# Altium schematic sheet Inverter.SchDoc
size A2; SheetNumber: 2; SheetTotal: 5
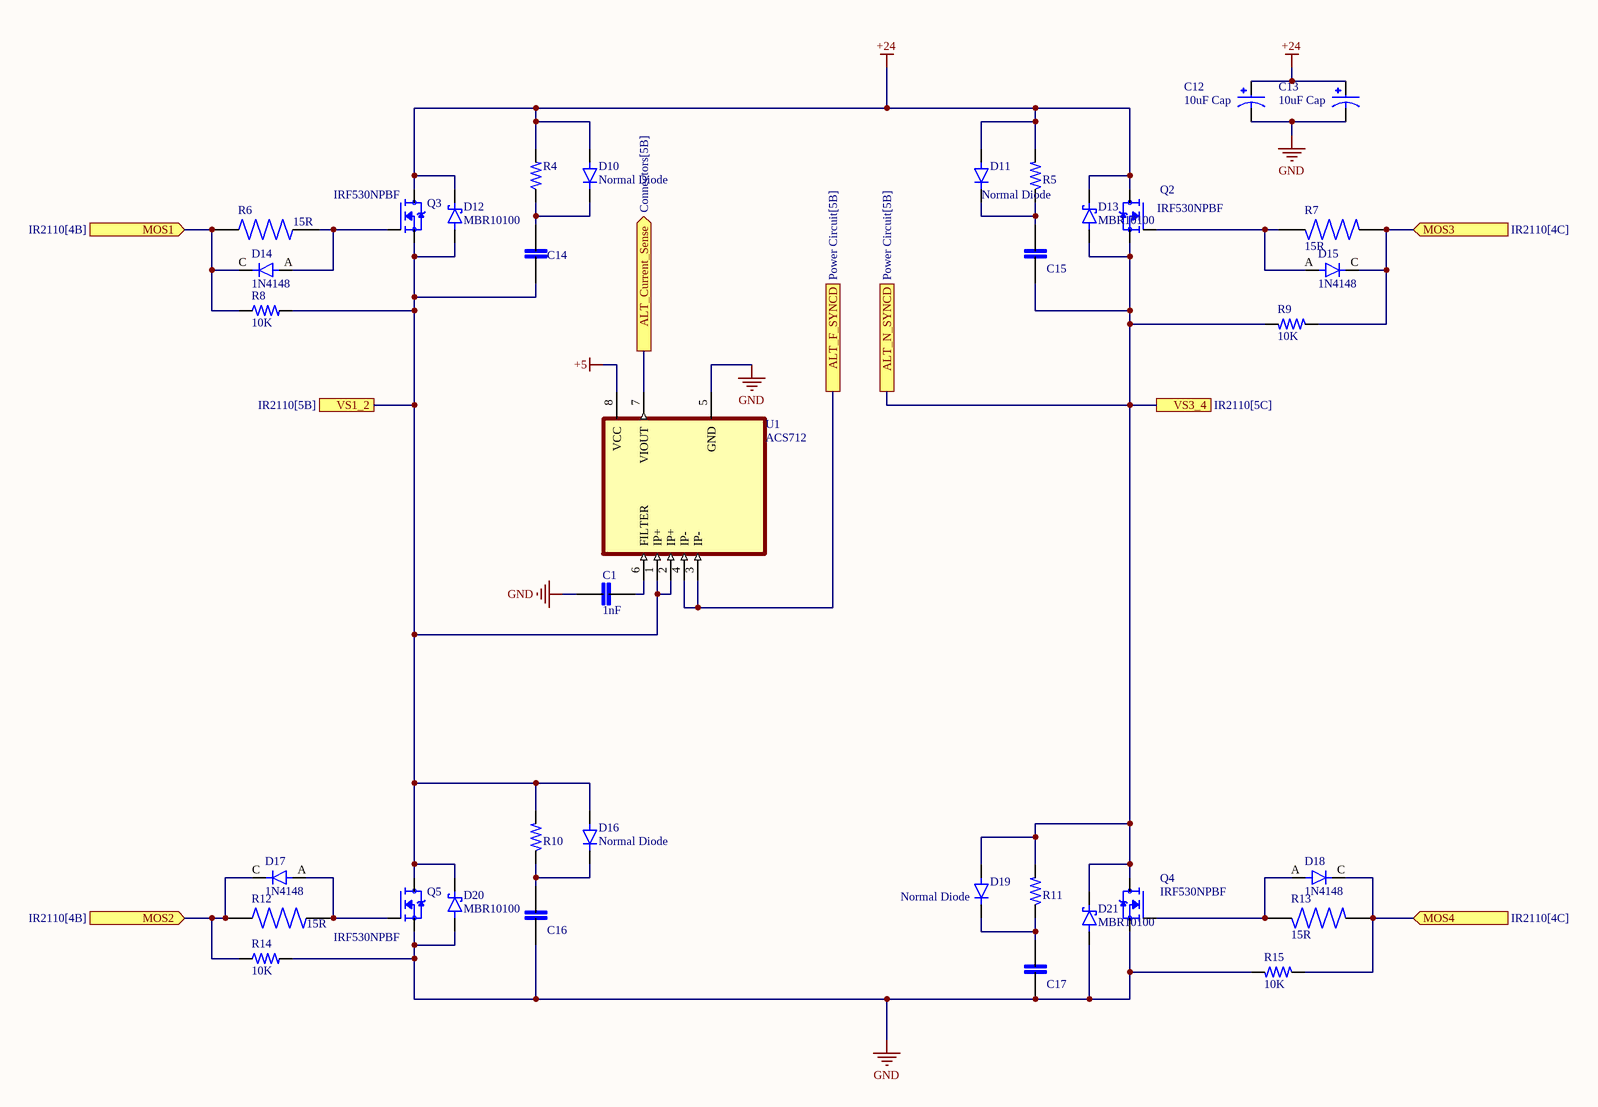
[diagram p0: Inverter.SchDoc]

## Parts
C1  1nF  [Ceramic Capacitor]
C12  10uF Cap  [2200uF_Cap]
C13  10uF Cap  [2200uF_Cap]
C14  Ceramic Capacitor  [Ceramic Capacitor]  (value not drawn)
C15  Ceramic Capacitor  [Ceramic Capacitor]  (value not drawn)
C16  Ceramic Capacitor  [Ceramic Capacitor]  (value not drawn)
C17  Ceramic Capacitor  [Ceramic Capacitor]  (value not drawn)
D10  Normal Diode  [Common Trhough Hole]
D11  Normal Diode  [Common Trhough Hole]
D12  MBR10100  [MBR10100]
D13  MBR10100  [MBR10100]
D14  1N4148  [1N4007 DIODE]
D15  1N4148  [1N4007 DIODE]
D16  Normal Diode  [Common Trhough Hole]
D17  1N4148  [1N4007 DIODE]
D18  1N4148  [1N4007 DIODE]
D19  Normal Diode  [Common Trhough Hole]
D20  MBR10100  [MBR10100]
D21  MBR10100  [MBR10100]
Q2  IRF530NPBF  [IRF530N]
Q3  IRF530NPBF  [IRF530N]
Q4  IRF530NPBF  [IRF530N]
Q5  IRF530NPBF  [IRF530N]
R4  Resistor  [Resistor_Through Hole]  (value not drawn)
R5  Resistor  [Resistor_Through Hole]  (value not drawn)
R6  15R  [Resistor_Through Hole]
R7  15R  [Resistor_Through Hole]
R8  10K  [Resistor_Through Hole]
R9  10K  [Resistor_Through Hole]
R10  Resistor  [Resistor_Through Hole]  (value not drawn)
R11  Resistor  [Resistor_Through Hole]  (value not drawn)
R12  15R  [Resistor_Through Hole]
R13  15R  [Resistor_Through Hole]
R14  10K  [Resistor_Through Hole]
R15  10K  [Resistor_Through Hole]
U1  ACS712  [ACS712]

## Ports
ALT_Current_Sense (out, see Connectors[5B]), ALT_F_SYNCD (see Power Circuit[5B]), ALT_N_SYNCD (see Power Circuit[5B]), MOS1 (in, see IR2110[4B]), MOS2 (in, see IR2110[4B]), MOS3 (in, see IR2110[4C]), MOS4 (in, see IR2110[4C]), VS1_2 (see IR2110[5B]), VS3_4 (see IR2110[5C])

## Nets
+5: U1.8(VCC)
+24: C12.P C13.P D10.2(A) D11.2(A) D12.1(K) D13.1(K) Q2.2(D) Q3.2(D) R4.2 R5.2
GND: C1.1 C12.N C13.N C16.1 C17.1 D20.3(A) D21.3(A) Q4.3(S) Q5.3(S) R14.2 R15.2 U1.5(GND)
ALT_Current_Sense: U1.7(VIOUT) ; port ALT_Current_Sense
ALT_F_SYNCD: U1.3(IP-) U1.4(IP-) ; port ALT_F_SYNCD
ALT_N_SYNCD: C15.1 D13.3(A) D19.2(A) D21.1(K) Q2.3(S) Q4.2(D) R9.2 R11.2 ; port VS3_4, port ALT_N_SYNCD
MOS1: D14.C R6.1 R8.1 ; port MOS1
MOS2: D17.C R12.1 R14.1 ; port MOS2
MOS3: D15.C R7.1 R9.1 ; port MOS3
MOS4: D18.C R13.1 R15.1 ; port MOS4
VS1_2: C14.1 D12.3(A) D16.2(A) D20.1(K) Q3.3(S) Q5.2(D) R8.2 R10.2 U1.1(IP+) U1.2(IP+) ; port VS1_2
NetC1_2: C1.2 U1.6(FILTER)
NetC14_2: C14.2 D10.1(K) R4.1
NetC15_2: C15.2 D11.1(K) R5.1
NetC16_2: C16.2 D16.1(K) R10.1
NetC17_2: C17.2 D19.1(K) R11.1
NetD14_A: D14.A Q3.1(G) R6.2
NetD15_A: D15.A Q2.1(G) R7.2
NetD17_A: D17.A Q5.1(G) R12.2
NetD18_A: D18.A Q4.1(G) R13.2

## Library data of the parts
C1 C14-C17 = Ceramic Capacitor: MP: LD051A121KAB2A; MF: AVX; SnapEDA_Link: https://www.snapeda.com/parts/LD051A121KAB2A/AVX/view-part/?ref=snap; Package: 0805 AVX; Check_prices: https://www.snapeda.com/parts/LD051A121KAB2A/AVX/view-part/?ref=eda; Purchase-URL: https://pricing.snapeda.com/search/part/LD051A121KAB2A/?ref=eda; Price: None; Value: *; Availability: In Stock
C12 C13 = 10uF Cap: CAP ALUM 10UF 20% 50V RADIAL; MP: ECE-A1HN100UI; MF: Panasonic; SnapEDA_Link: https://www.snapeda.com/parts/ECE-A1HN100UI/Panasonic/view-part/2321690/?ref=snap; Price: None; Check_prices: https://www.snapeda.com/parts/ECE-A1HN100UI/Panasonic/view-part/2321690/?ref=eda; Value: *; Availability: In Stock; Package: RADIAL-2 Panasonic
D10 D11 D16 D19 = Normal Diode: MF: NTE Electronics, Inc.; MP: 1N4007; Package: DO-41 NTE Electronics; Check_prices: https://www.snapeda.com/parts/1N4007/NTE+Electronics/view-part/?ref=eda; Value: *; Purchase-URL: https://pricing.snapeda.com/search/part/1N4007/?ref=eda; Availability: In Stock; SnapEDA_Link: https://www.snapeda.com/parts/1N4007/NTE+Electronics/view-part/?ref=snap; Price: None
D12 D13 D20 D21 = MBR10100: MF: Diodes Inc.; MP: 1N5817-T; Package: DO-41 Diodes Inc.; Price: None; Check_prices: https://www.snapeda.com/parts/1N5817-T/Diodes+Inc./view-part/?ref=eda; Value: *; SnapEDA_Link: https://www.snapeda.com/parts/1N5817-T/Diodes+Inc./view-part/?ref=snap; Availability: In Stock; Purchase-URL: https://pricing.snapeda.com/search/part/1N5817-T/?ref=eda
D14 D15 D17 D18 = 1N4007: Diode Standard 1000 V 1A Through Hole DO-41; MF: NTE Electronics, Inc.; Package: DO-41 NTE Electronics; Check_prices: https://www.snapeda.com/parts/1N4007/NTE+Electronics/view-part/?ref=eda; Value: *; Purchase-URL: https://pricing.snapeda.com/search/part/1N4007/?ref=eda; Availability: In Stock; SnapEDA_Link: https://www.snapeda.com/parts/1N4007/NTE+Electronics/view-part/?ref=snap; MP: 1N4007; Price: None
Q2-Q5 = IRF530NPBF: RoHS Compliant | Low RDS(on) | Industry-leading quality | Dynamic dv/dt Rating | Fast Switching | Fully Avalanche Rated | 175C Operating Temperature; MF: Infineon Technologies; Purchase-URL: https://pricing.snapeda.com/search/part/IRF530NPBF/?ref=eda; Check_prices: https://www.snapeda.com/parts/IRF530NPBF/Infineon+Technologies/view-part/?ref=eda; SnapEDA_Link: https://www.snapeda.com/parts/IRF530NPBF/Infineon+Technologies/view-part/?ref=snap; Price: None; Availability: In Stock; Package: TO-220 Infineon; MP: IRF530NPBF; Value: *
R4 R5 R8-R11 R14 R15 = Resistor: Power_Rating: .25 W; MP: 2-2176053-0; Tolerance: 1%; Resistance: .33; MF: TE Connectivity; Price: None; Availability: In Stock; EU_RoHS_Compliance: Compliant with Exemptions; Package: 0805; Value: *; SnapEDA_Link: https://www.snapeda.com/parts/2-2176053-0/TE+Connectivity/view-part/?ref=snap; Check_prices: https://www.snapeda.com/parts/2-2176053-0/TE+Connectivity/view-part/?ref=eda
R6 R7 R12 R13 = Resistor_Through Hole: 1.02 Ohms Â±1% 0.25W, 1/4W Through Hole Resistor Axial Metal Film; MP: MFR-25FTE52-1R; MF: Yageo; Availability: Warning; Value: *; Check_prices: https://www.snapeda.com/parts/MFR-25FTE52-1R/Yageo/view-part/4629919/?ref=eda; Package: Axial Yageo; Price: None; SnapEDA_Link: https://www.snapeda.com/parts/MFR-25FTE52-1R/Yageo/view-part/4629919/?ref=snap; Purchase-URL: https://pricing.snapeda.com/search/part/MFR-25FTE52-1R/?ref=eda
U1 = ACS712: Current Sensor 5A 1 Channel Hall Effect, Open Loop Bidirectional 8-SOIC (0.154, 3.90mm Width); MP: ACS712ELCTR-05B-T; MF: Allegro MicroSystems LLC; SnapEDA_Link: https://www.snapeda.com/parts/ACS712ELCTR-05B-T/Allegro+MicroSystems+LLC/view-part/?ref=snap; Package: SOIC-8 Allegro MicroSystems LLC; Check_prices: https://www.snapeda.com/parts/ACS712ELCTR-05B-T/Allegro+MicroSystems+LLC/view-part/?ref=eda; Purchase-URL: https://pricing.snapeda.com/search/part/ACS712ELCTR-05B-T/?ref=eda; Price: None; Value: *; Availability: In Stock